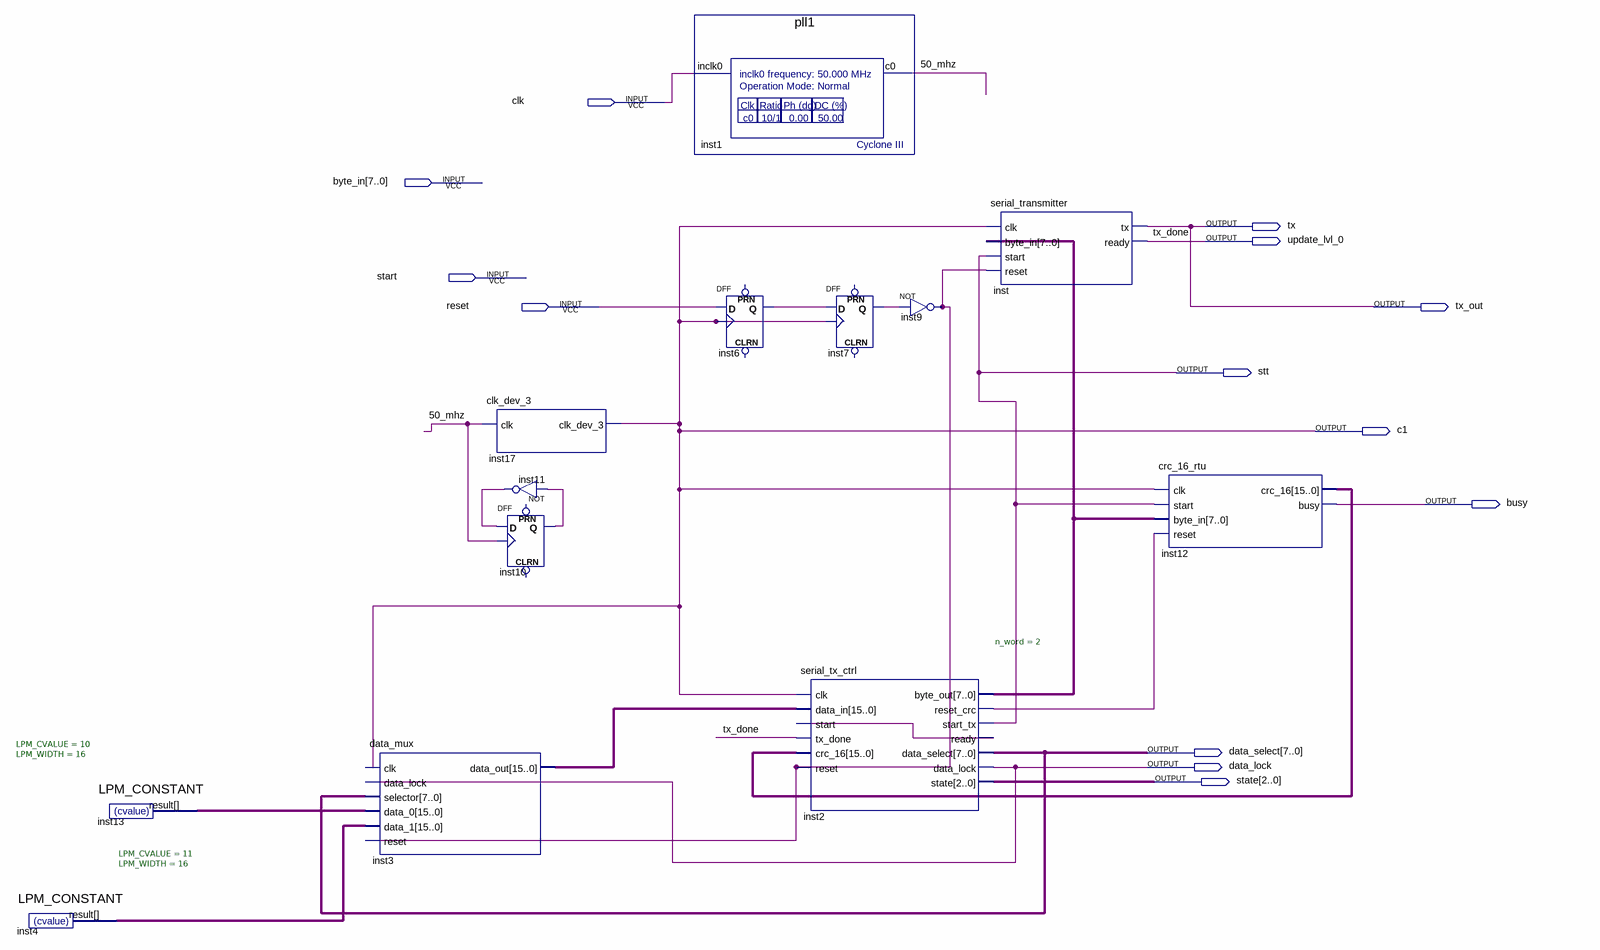
[diagram p0: schematic sheet]
// Quartus schematic master_serial.bdf as structural Verilog: 13 symbols, 13 pins
module master_serial (
  input  clk,
  input  [7:0] byte_in,
  input  start,
  input  reset,
  output tx,
  output update_lvl_0,
  output tx_out,
  output stt,
  output c1,
  output busy,
  output [7:0] data_select,
  output data_lock,
  output [2:0] state
);

  wire \50_mhz , inst2_ready, inst2_reset_crc, inst6_q, inst7_q, inst9_out, inst10_q, inst11_out;
  wire [7:0] inst2_byte_out;
  wire [15:0] inst3_data_out, inst4_result, inst12_crc_16, inst13_result;

  LPM_CONSTANT #(.LPM_CVALUE(11), .LPM_WIDTH(16)) inst4 (.result(inst4_result));
  LPM_CONSTANT #(.LPM_CVALUE(10), .LPM_WIDTH(16)) inst13 (.result(inst13_result));
  data_mux inst3 (
    .clk(c1), .data_lock(data_lock), .selector(data_select), .data_0(inst13_result), .data_1(inst4_result),
    .reset(inst9_out), .data_out(inst3_data_out));
  clk_dev_3 inst17 (.clk(\50_mhz ), .clk_dev_3(c1));
  DFF inst10 (.CLK(\50_mhz ), .D(inst11_out), .Q(inst10_q));  // open: CLRN, PRN
  not inst11 (inst11_out, inst10_q);
  pll1 inst1 (.inclk0(clk), .c0(\50_mhz ));
  DFF inst6 (.CLK(c1), .D(reset), .Q(inst6_q));  // open: CLRN, PRN
  DFF inst7 (.CLK(c1), .D(inst6_q), .Q(inst7_q));  // open: CLRN, PRN
  serial_tx_ctrl #(.n_word(2)) inst2 (
    .clk(c1), .data_in(inst3_data_out), .start(inst2_ready), .tx_done(update_lvl_0), .crc_16(inst12_crc_16),
    .reset(inst9_out), .byte_out(inst2_byte_out), .reset_crc(inst2_reset_crc), .start_tx(stt),
    .ready(inst2_ready), .data_select(data_select), .data_lock(data_lock), .state(state));
  not inst9 (inst9_out, inst7_q);
  serial_transmitter inst (
    .clk(c1), .byte_in(inst2_byte_out), .start(stt), .reset(inst9_out), .tx(tx), .ready(update_lvl_0));
  crc_16_rtu inst12 (
    .clk(c1), .start(stt), .byte_in(inst2_byte_out), .reset(inst2_reset_crc), .crc_16(inst12_crc_16),
    .busy(busy));

  assign tx_out = tx;

  // Other names for the same wires on the sheet: tx_done = update_lvl_0
endmodule
